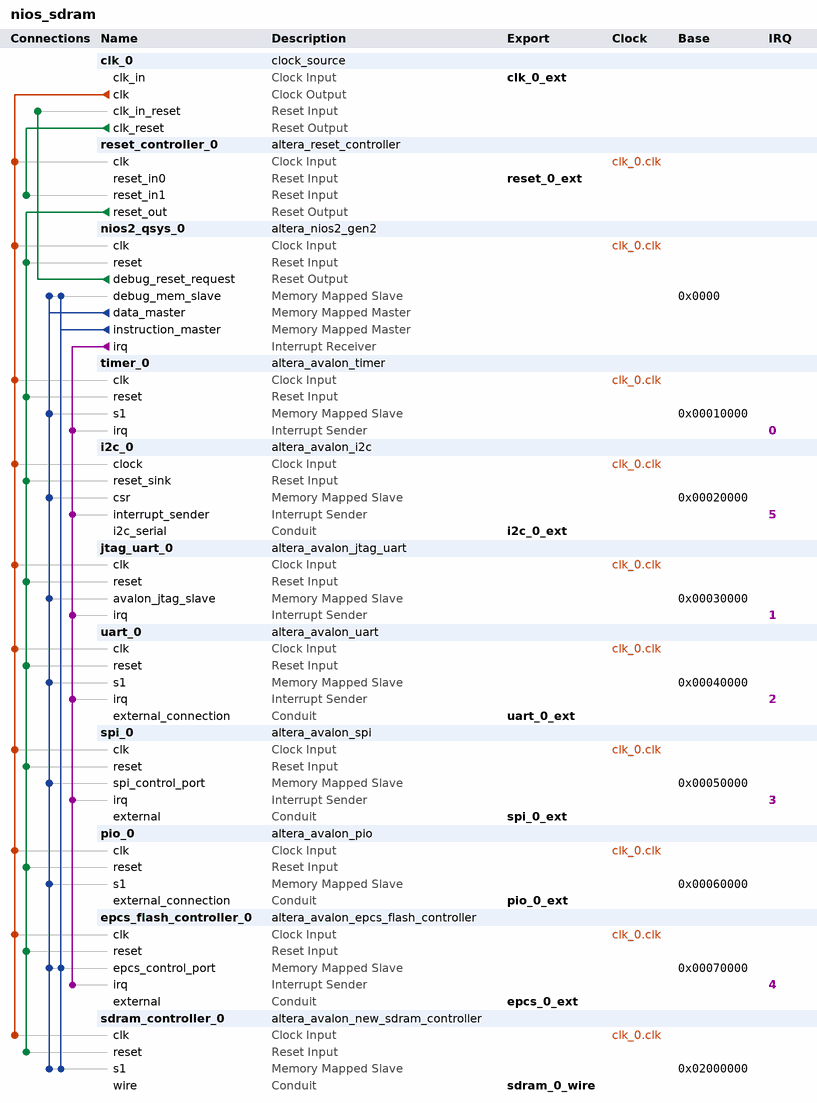
[diagram p0: system contents]
# Platform Designer (Qsys) system nios_sdram, Cyclone IV E EP4CE10E22C8
# Parameters at their usual value, and those the tool derives, are not listed.
package require -exact qsys 17.0
create_system nios_sdram
set_project_property DEVICE_FAMILY {Cyclone IV E}
set_project_property DEVICE EP4CE10E22C8

add_instance clk_0 clock_source 17.0
set_instance_parameter_value clk_0 clockFrequency 50000000

add_instance reset_controller_0 altera_reset_controller 17.0
set_instance_parameter_value reset_controller_0 NUM_RESET_INPUTS 2
set_instance_parameter_value reset_controller_0 SYNC_DEPTH 2

add_instance nios2_qsys_0 altera_nios2_gen2 17.0
set_instance_parameter_value nios2_qsys_0 dcache_size 2048
set_instance_parameter_value nios2_qsys_0 exceptionSlave sdram_controller_0.s1
set_instance_parameter_value nios2_qsys_0 icache_size 4096
set_instance_parameter_value nios2_qsys_0 impl Tiny
set_instance_parameter_value nios2_qsys_0 resetSlave epcs_flash_controller_0.epcs_control_port
set_instance_parameter_value nios2_qsys_0 setting_activateTrace true

add_instance timer_0 altera_avalon_timer 17.0
set_instance_parameter_value timer_0 period 1
set_instance_parameter_value timer_0 periodUnits MSEC

add_instance i2c_0 altera_avalon_i2c 17.0
set_instance_parameter_value i2c_0 FIFO_DEPTH 4

add_instance jtag_uart_0 altera_avalon_jtag_uart 17.0
set_instance_parameter_value jtag_uart_0 allowMultipleConnections true
set_instance_parameter_value jtag_uart_0 readBufferDepth 32
set_instance_parameter_value jtag_uart_0 simInteractiveOptions NO_INTERACTIVE_WINDOWS
set_instance_parameter_value jtag_uart_0 writeBufferDepth 128

add_instance uart_0 altera_avalon_uart 17.0
set_instance_parameter_value uart_0 baud 115200
set_instance_parameter_value uart_0 dataBits 8
set_instance_parameter_value uart_0 fixedBaud false
set_instance_parameter_value uart_0 parity NONE
set_instance_parameter_value uart_0 stopBits 1

add_instance spi_0 altera_avalon_spi 17.0
set_instance_parameter_value spi_0 clockPolarity 0
set_instance_parameter_value spi_0 dataWidth 8
set_instance_parameter_value spi_0 masterSPI true
set_instance_parameter_value spi_0 numberOfSlaves 1
set_instance_parameter_value spi_0 targetClockRate 128000

add_instance pio_0 altera_avalon_pio 17.0
set_instance_parameter_value pio_0 bitModifyingOutReg true
set_instance_parameter_value pio_0 direction Bidir
set_instance_parameter_value pio_0 width 16

add_instance epcs_flash_controller_0 altera_avalon_epcs_flash_controller 17.0
set_instance_parameter_value epcs_flash_controller_0 autoSelectASMIAtom false
set_instance_parameter_value epcs_flash_controller_0 resetrequest_enabled true

add_instance sdram_controller_0 altera_avalon_new_sdram_controller 17.0
set_instance_parameter_value sdram_controller_0 TAC 6.0
set_instance_parameter_value sdram_controller_0 TRCD 15.0
set_instance_parameter_value sdram_controller_0 TRFC 65.0
set_instance_parameter_value sdram_controller_0 TRP 20.0
set_instance_parameter_value sdram_controller_0 casLatency 3
set_instance_parameter_value sdram_controller_0 columnWidth 9
set_instance_parameter_value sdram_controller_0 dataWidth 16
set_instance_parameter_value sdram_controller_0 generateSimulationModel false
set_instance_parameter_value sdram_controller_0 model single_Micron_MT48LC4M32B2_7_chip
set_instance_parameter_value sdram_controller_0 numberOfBanks 4
set_instance_parameter_value sdram_controller_0 numberOfChipSelects 1
set_instance_parameter_value sdram_controller_0 powerUpDelay 200.0
set_instance_parameter_value sdram_controller_0 refreshPeriod 15.625
set_instance_parameter_value sdram_controller_0 rowWidth 13

# connections
add_connection clk_0.clk epcs_flash_controller_0.clk clock
add_connection clk_0.clk i2c_0.clock clock
add_connection clk_0.clk jtag_uart_0.clk clock
add_connection clk_0.clk nios2_qsys_0.clk clock
add_connection clk_0.clk pio_0.clk clock
add_connection clk_0.clk reset_controller_0.clk clock
add_connection clk_0.clk sdram_controller_0.clk clock
add_connection clk_0.clk spi_0.clk clock
add_connection clk_0.clk timer_0.clk clock
add_connection clk_0.clk uart_0.clk clock
add_connection clk_0.clk_reset reset_controller_0.reset_in1 reset
add_connection nios2_qsys_0.debug_reset_request clk_0.clk_in_reset reset
add_connection reset_controller_0.reset_out epcs_flash_controller_0.reset reset
add_connection reset_controller_0.reset_out i2c_0.reset_sink reset
add_connection reset_controller_0.reset_out jtag_uart_0.reset reset
add_connection reset_controller_0.reset_out nios2_qsys_0.reset reset
add_connection reset_controller_0.reset_out pio_0.reset reset
add_connection reset_controller_0.reset_out sdram_controller_0.reset reset
add_connection reset_controller_0.reset_out spi_0.reset reset
add_connection reset_controller_0.reset_out timer_0.reset reset
add_connection reset_controller_0.reset_out uart_0.reset reset
add_connection nios2_qsys_0.data_master epcs_flash_controller_0.epcs_control_port avalon
set_connection_parameter_value nios2_qsys_0.data_master/epcs_flash_controller_0.epcs_control_port baseAddress 0x00070000
add_connection nios2_qsys_0.data_master i2c_0.csr avalon
set_connection_parameter_value nios2_qsys_0.data_master/i2c_0.csr baseAddress 0x00020000
add_connection nios2_qsys_0.data_master jtag_uart_0.avalon_jtag_slave avalon
set_connection_parameter_value nios2_qsys_0.data_master/jtag_uart_0.avalon_jtag_slave baseAddress 0x00030000
add_connection nios2_qsys_0.data_master nios2_qsys_0.debug_mem_slave avalon
set_connection_parameter_value nios2_qsys_0.data_master/nios2_qsys_0.debug_mem_slave baseAddress 0x0000
add_connection nios2_qsys_0.data_master pio_0.s1 avalon
set_connection_parameter_value nios2_qsys_0.data_master/pio_0.s1 baseAddress 0x00060000
add_connection nios2_qsys_0.data_master sdram_controller_0.s1 avalon
set_connection_parameter_value nios2_qsys_0.data_master/sdram_controller_0.s1 baseAddress 0x02000000
add_connection nios2_qsys_0.data_master spi_0.spi_control_port avalon
set_connection_parameter_value nios2_qsys_0.data_master/spi_0.spi_control_port baseAddress 0x00050000
add_connection nios2_qsys_0.data_master timer_0.s1 avalon
set_connection_parameter_value nios2_qsys_0.data_master/timer_0.s1 baseAddress 0x00010000
add_connection nios2_qsys_0.data_master uart_0.s1 avalon
set_connection_parameter_value nios2_qsys_0.data_master/uart_0.s1 baseAddress 0x00040000
add_connection nios2_qsys_0.instruction_master epcs_flash_controller_0.epcs_control_port avalon
set_connection_parameter_value nios2_qsys_0.instruction_master/epcs_flash_controller_0.epcs_control_port baseAddress 0x00070000
add_connection nios2_qsys_0.instruction_master nios2_qsys_0.debug_mem_slave avalon
set_connection_parameter_value nios2_qsys_0.instruction_master/nios2_qsys_0.debug_mem_slave baseAddress 0x0000
add_connection nios2_qsys_0.instruction_master sdram_controller_0.s1 avalon
set_connection_parameter_value nios2_qsys_0.instruction_master/sdram_controller_0.s1 baseAddress 0x02000000
add_connection nios2_qsys_0.irq epcs_flash_controller_0.irq interrupt
set_connection_parameter_value nios2_qsys_0.irq/epcs_flash_controller_0.irq irqNumber 4
add_connection nios2_qsys_0.irq i2c_0.interrupt_sender interrupt
set_connection_parameter_value nios2_qsys_0.irq/i2c_0.interrupt_sender irqNumber 5
add_connection nios2_qsys_0.irq jtag_uart_0.irq interrupt
set_connection_parameter_value nios2_qsys_0.irq/jtag_uart_0.irq irqNumber 1
add_connection nios2_qsys_0.irq spi_0.irq interrupt
set_connection_parameter_value nios2_qsys_0.irq/spi_0.irq irqNumber 3
add_connection nios2_qsys_0.irq timer_0.irq interrupt
set_connection_parameter_value nios2_qsys_0.irq/timer_0.irq irqNumber 0
add_connection nios2_qsys_0.irq uart_0.irq interrupt
set_connection_parameter_value nios2_qsys_0.irq/uart_0.irq irqNumber 2

# exported interfaces
add_interface clk_0_ext clock sink
set_interface_property clk_0_ext EXPORT_OF clk_0.clk_in
add_interface epcs_0_ext conduit end
set_interface_property epcs_0_ext EXPORT_OF epcs_flash_controller_0.external
add_interface i2c_0_ext conduit end
set_interface_property i2c_0_ext EXPORT_OF i2c_0.i2c_serial
add_interface pio_0_ext conduit end
set_interface_property pio_0_ext EXPORT_OF pio_0.external_connection
add_interface reset_0_ext reset sink
set_interface_property reset_0_ext EXPORT_OF reset_controller_0.reset_in0
add_interface sdram_0_wire conduit end
set_interface_property sdram_0_wire EXPORT_OF sdram_controller_0.wire
add_interface spi_0_ext conduit end
set_interface_property spi_0_ext EXPORT_OF spi_0.external
add_interface uart_0_ext conduit end
set_interface_property uart_0_ext EXPORT_OF uart_0.external_connection

set_interconnect_requirement {$system} qsys_mm.clockCrossingAdapter HANDSHAKE
set_interconnect_requirement {$system} qsys_mm.maxAdditionalLatency 1

save_system nios_sdram.qsys
